# EAGLE schematic Senior_Project_Board_v2 (EAGLE 8.3.2)
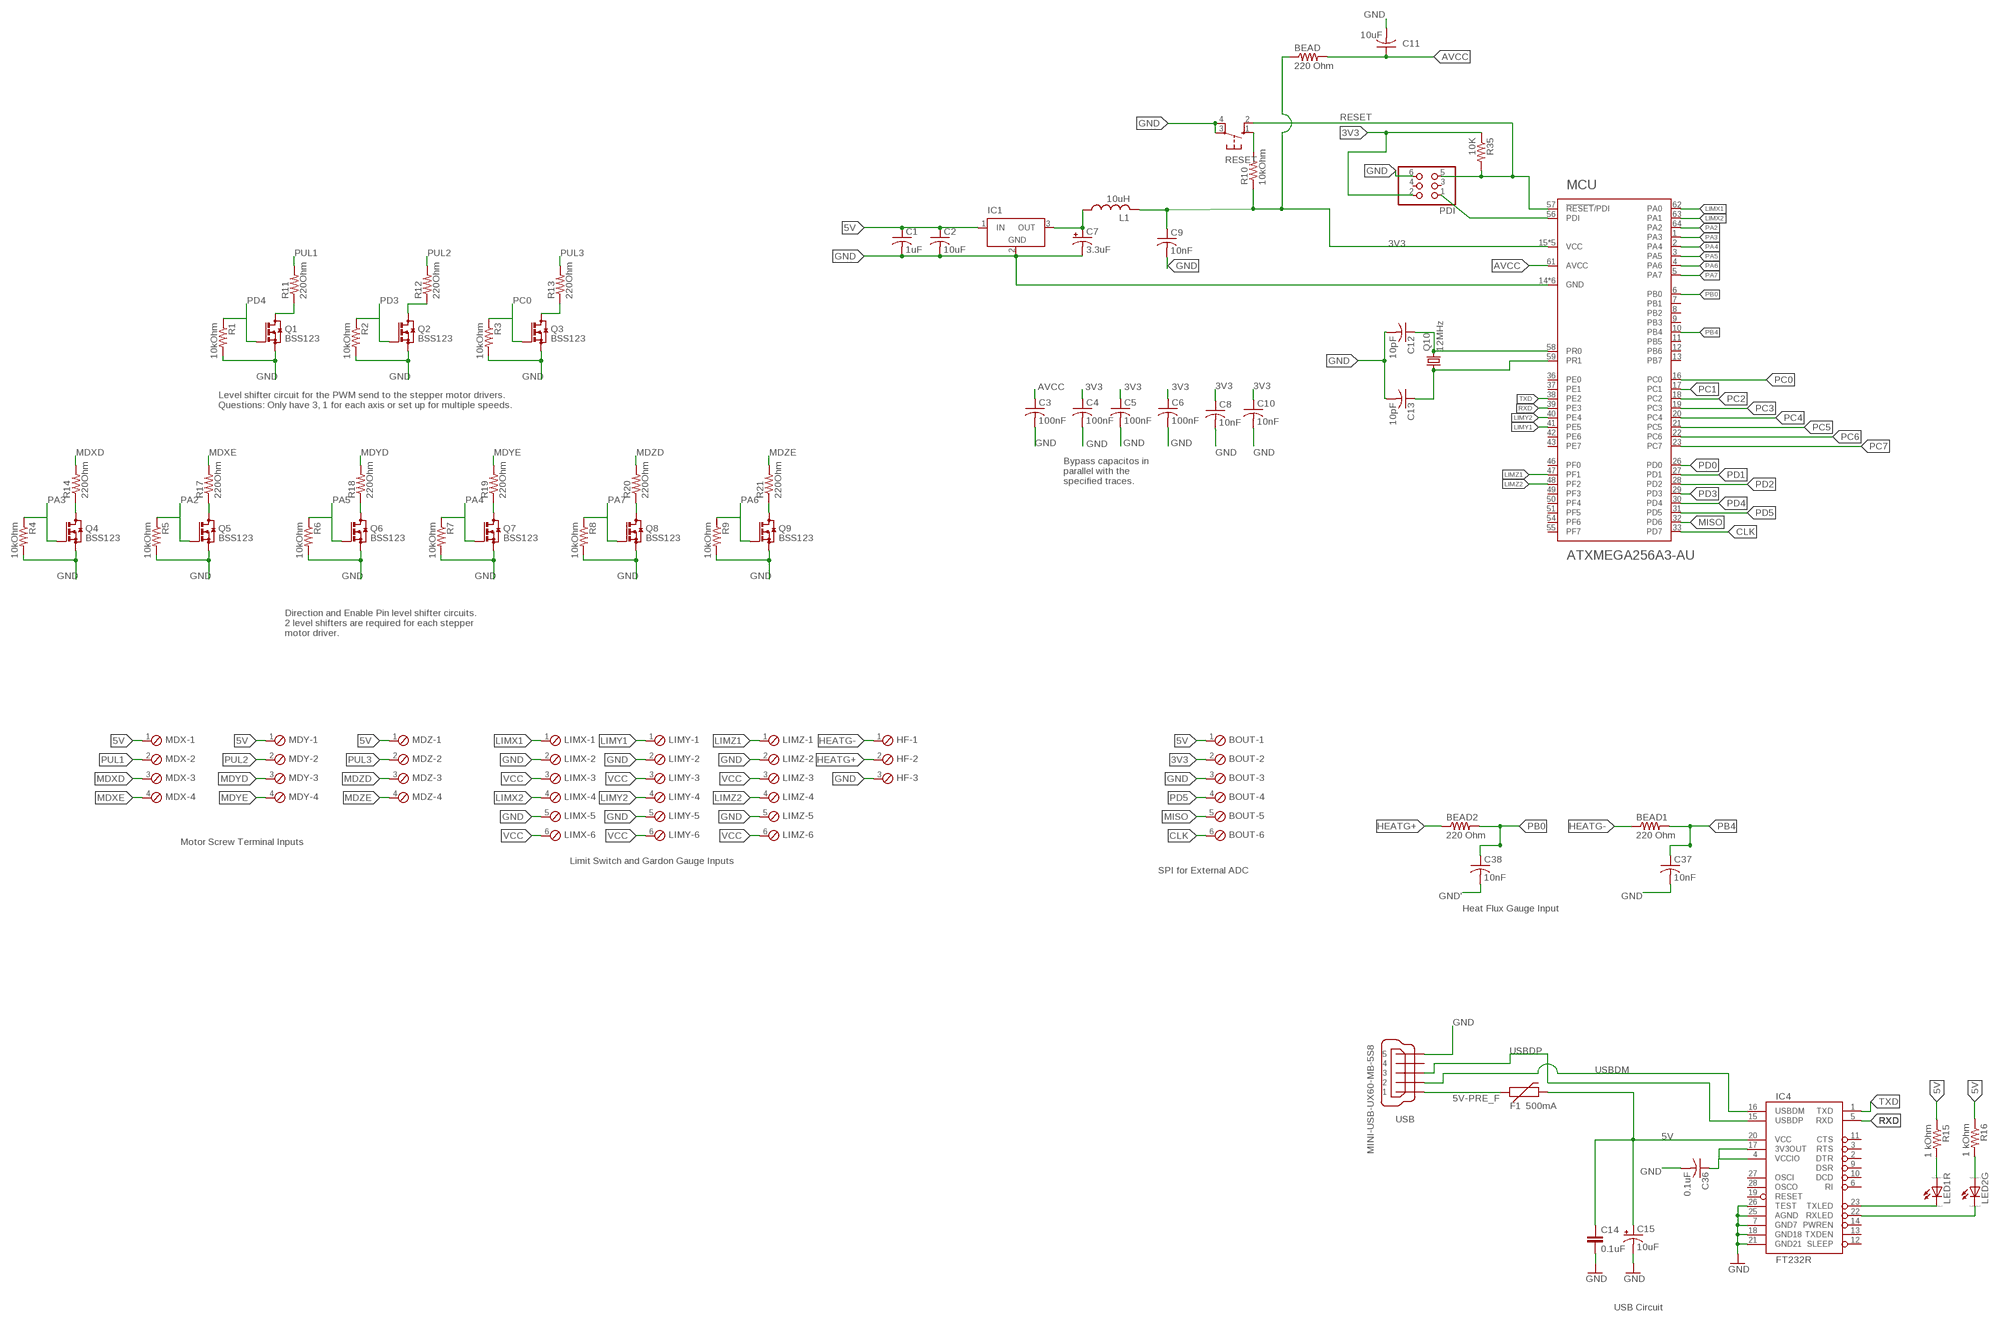
[diagram p0: schematic, sheet 1, part 1 of 3]
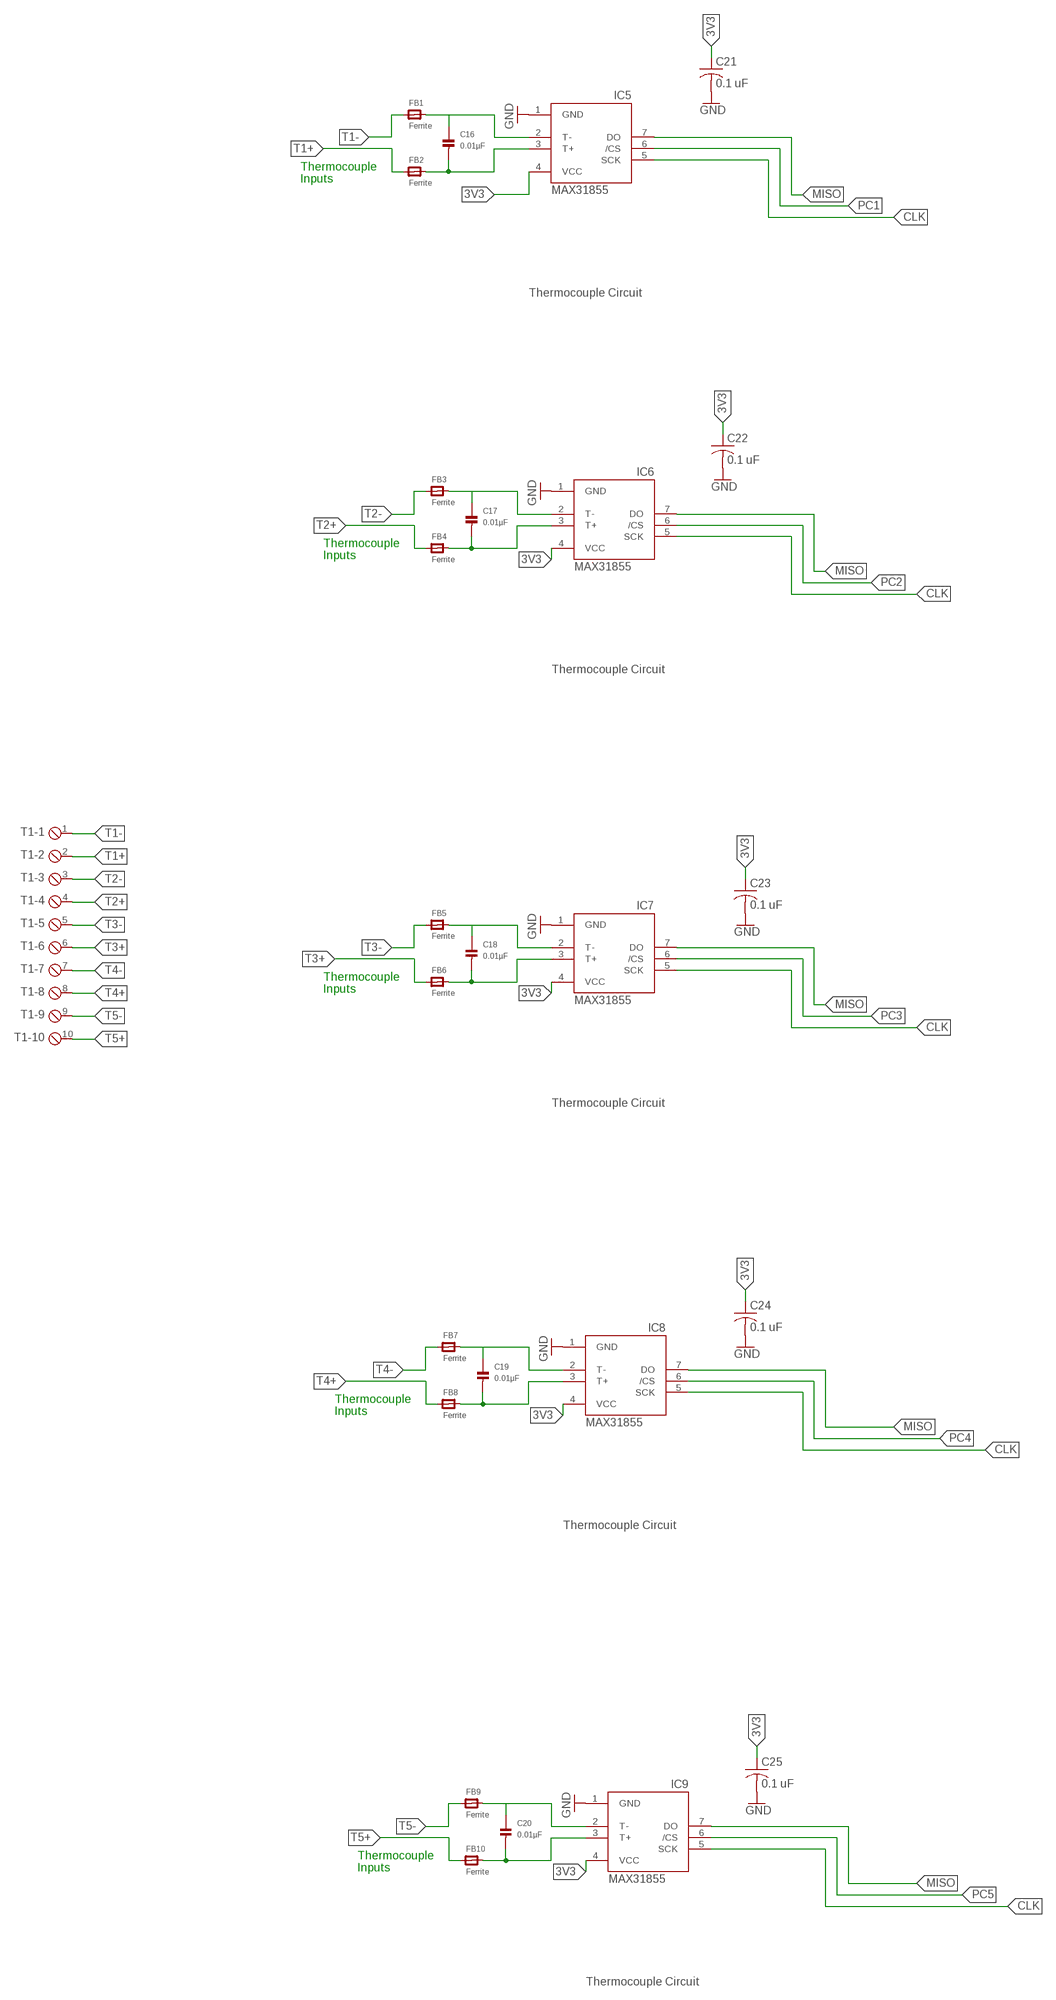
[diagram p1: schematic, sheet 1, part 2 of 3]
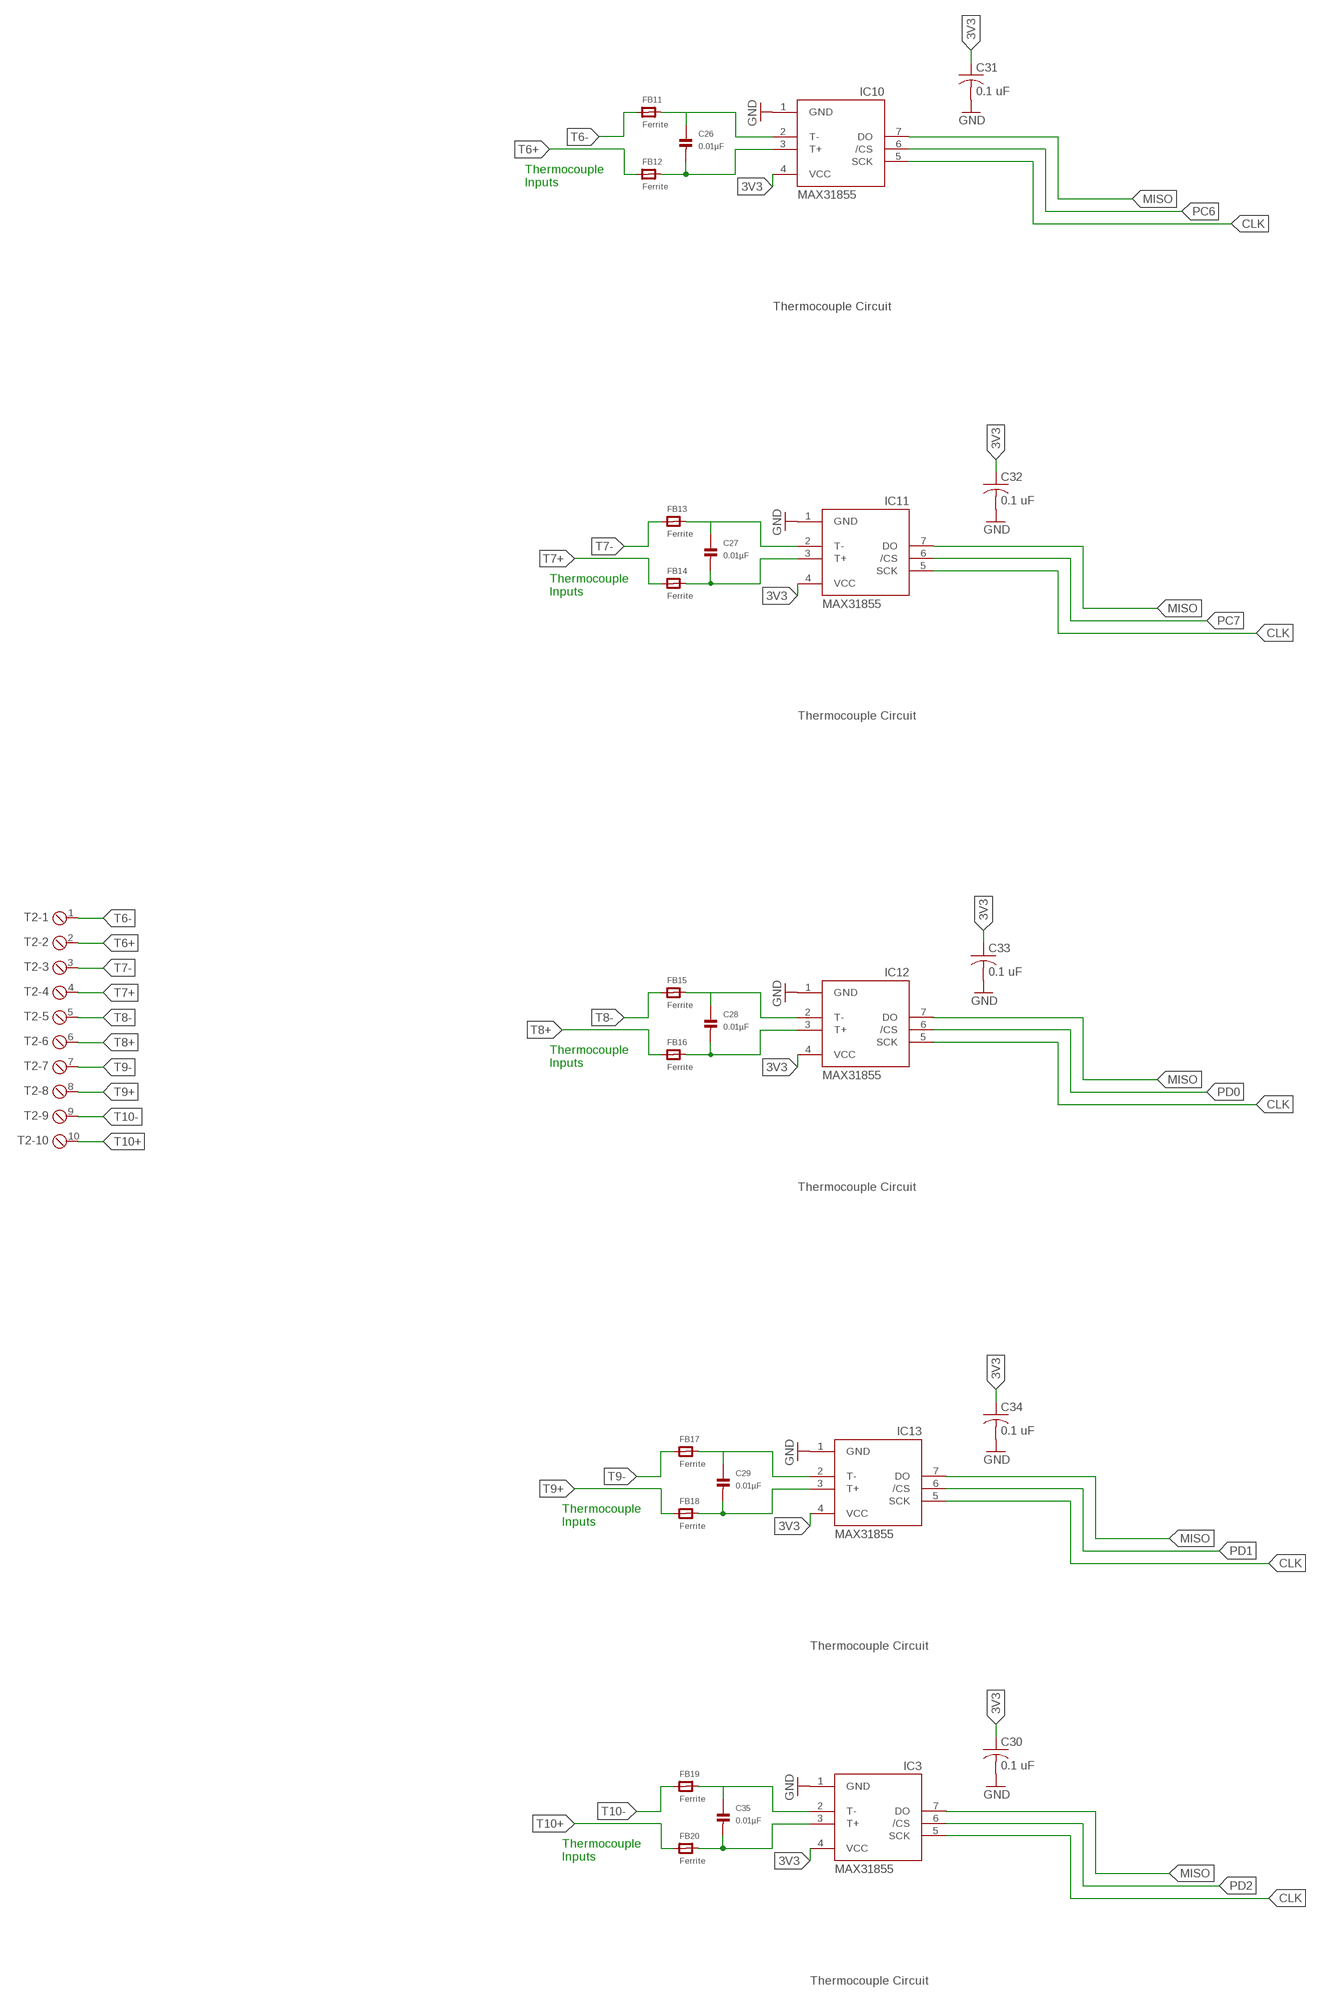
[diagram p2: schematic, sheet 1, part 3 of 3]

## Parts
BEAD  220 Ohm  R-US_R0805  [R0805]
BEAD1  220 Ohm  R-US_R0805  [R0805]
BEAD2  220 Ohm  R-US_R0805  [R0805]
BOUT  MPT6  [6POL254]
C1  1uF  C-USC0805  [C0805]
C2  10uF  C-USC0805  [C0805]
C3  100nF  C-USC0805  [C0805]
C4  100nF  C-USC0805  [C0805]
C5  100nF  C-USC0805  [C0805]
C6  100nF  C-USC0805  [C0805]
C7  3.3uF  CPOL-USCT3216  [CT3216]
C8  10nF  C-USC0805  [C0805]
C9  10nF  C-USC0805  [C0805]
C10  10nF  C-USC0805  [C0805]
C11  10uF  C-USC0805  [C0805]
C12  10pF  C-USC0805  [C0805]
C13  10pF  C-USC0805  [C0805]
C14  0.1uF  0.1UF-25V(+80/-20%)(0603)  [0603-CAP]
C15  10uF  10UF-16V-10%(TANT)  [EIA3216]
C16  0.01µF  CAP_CERAMIC_0805  [_0805]
C17  0.01µF  CAP_CERAMIC_0805  [_0805]
C18  0.01µF  CAP_CERAMIC_0805  [_0805]
C19  0.01µF  CAP_CERAMIC_0805  [_0805]
C20  0.01µF  CAP_CERAMIC_0805  [_0805]
C21  0.1 uF  C-USC0805K  [C0805K]
C22  0.1 uF  C-USC0805K  [C0805K]
C23  0.1 uF  C-USC0805K  [C0805K]
C24  0.1 uF  C-USC0805K  [C0805K]
C25  0.1 uF  C-USC0805K  [C0805K]
C26  0.01µF  CAP_CERAMIC_0805  [_0805]
C27  0.01µF  CAP_CERAMIC_0805  [_0805]
C28  0.01µF  CAP_CERAMIC_0805  [_0805]
C29  0.01µF  CAP_CERAMIC_0805  [_0805]
C30  0.1 uF  C-USC0805K  [C0805K]
C31  0.1 uF  C-USC0805K  [C0805K]
C32  0.1 uF  C-USC0805K  [C0805K]
C33  0.1 uF  C-USC0805K  [C0805K]
C34  0.1 uF  C-USC0805K  [C0805K]
C35  0.01µF  CAP_CERAMIC_0805  [_0805]
C36  0.1uF  C-USC0805  [C0805]
C37  10nF  C-USC0805  [C0805]
C38  10nF  C-USC0805  [C0805]
F1  500mA  PTCSMD  [PTC-1206]
FB1  Ferrite  FERRITE_0805  [_0805]
FB2  Ferrite  FERRITE_0805  [_0805]
FB3  Ferrite  FERRITE_0805  [_0805]
FB4  Ferrite  FERRITE_0805  [_0805]
FB5  Ferrite  FERRITE_0805  [_0805]
FB6  Ferrite  FERRITE_0805  [_0805]
FB7  Ferrite  FERRITE_0805  [_0805]
FB8  Ferrite  FERRITE_0805  [_0805]
FB9  Ferrite  FERRITE_0805  [_0805]
FB10  Ferrite  FERRITE_0805  [_0805]
FB11  Ferrite  FERRITE_0805  [_0805]
FB12  Ferrite  FERRITE_0805  [_0805]
FB13  Ferrite  FERRITE_0805  [_0805]
FB14  Ferrite  FERRITE_0805  [_0805]
FB15  Ferrite  FERRITE_0805  [_0805]
FB16  Ferrite  FERRITE_0805  [_0805]
FB17  Ferrite  FERRITE_0805  [_0805]
FB18  Ferrite  FERRITE_0805  [_0805]
FB19  Ferrite  FERRITE_0805  [_0805]
FB20  Ferrite  FERRITE_0805  [_0805]
HF  MPT3  [3POL254]
IC1  LT1129CST5  [SOT223]
IC3  MAX31855  MAX6675  [SO08]
IC4  FT232R  FT232RLSSOP  [SSOP28DB]
IC5  MAX31855  MAX6675  [SO08]
IC6  MAX31855  MAX6675  [SO08]
IC7  MAX31855  MAX6675  [SO08]
IC8  MAX31855  MAX6675  [SO08]
IC9  MAX31855  MAX6675  [SO08]
IC10  MAX31855  MAX6675  [SO08]
IC11  MAX31855  MAX6675  [SO08]
IC12  MAX31855  MAX6675  [SO08]
IC13  MAX31855  MAX6675  [SO08]
L1  10uH  L-USL1812  [L1812]
LED1R  LED_E  [LED_1206]
LED2G  LED_E  [LED_1206]
LIMX  MPT6  [6POL254]
LIMY  MPT6  [6POL254]
LIMZ  MPT6  [6POL254]
MCU  ATXMEGA256A3-AU  [TQFP-64A-64]
MDX  MPT4  [4POL254]
MDY  MPT4  [4POL254]
MDZ  MPT4  [4POL254]
PDI  PINHD-2X3  [2X03]
Q1  BSS123  [SOT23]
Q2  BSS123  [SOT23]
Q3  BSS123  [SOT23]
Q4  BSS123  [SOT23]
Q5  BSS123  [SOT23]
Q6  BSS123  [SOT23]
Q7  BSS123  [SOT23]
Q8  BSS123  [SOT23]
Q9  BSS123  [SOT23]
Q10  12MHz  CRYSTALHC49S  [HC49/S]
R1  10kOhm  R-US_R0805  [R0805]
R2  10kOhm  R-US_R0805  [R0805]
R3  10kOhm  R-US_R0805  [R0805]
R4  10kOhm  R-US_R0805  [R0805]
R5  10kOhm  R-US_R0805  [R0805]
R6  10kOhm  R-US_R0805  [R0805]
R7  10kOhm  R-US_R0805  [R0805]
R8  10kOhm  R-US_R0805  [R0805]
R9  10kOhm  R-US_R0805  [R0805]
R10  10kOhm  R-US_R0805  [R0805]
R11  220Ohm  R-US_R0805  [R0805]
R12  220Ohm  R-US_R0805  [R0805]
R13  220Ohm  R-US_R0805  [R0805]
R14  220Ohm  R-US_R0805  [R0805]
R15  1 kOhm  R-US_R0805  [R0805]
R16  1 kOhm  R-US_R0805  [R0805]
R17  220Ohm  R-US_R0805  [R0805]
R18  220Ohm  R-US_R0805  [R0805]
R19  220Ohm  R-US_R0805  [R0805]
R20  220Ohm  R-US_R0805  [R0805]
R21  220Ohm  R-US_R0805  [R0805]
R35  10K  R-US_R0805  [R0805]
RESET  10-XX  [B3F-10XX]
T1  MPT10  [10POL254]
T2  MPT10  [10POL254]
USB  MINI-USB-UX60-MB-5S8  [UX60-MB-5S8]

## Nets
3V3: BEAD.1 BOUT.2 C4.1 C5.1 C6.1 C8.1 C9.1 C10.1 C21.1 C22.1 C23.1 C24.1 C25.1 C30.1 C31.1 C32.1 C33.1 C34.1 IC3.4(VCC) IC5.4(VCC) IC6.4(VCC) IC7.4(VCC) IC8.4(VCC) IC9.4(VCC) IC10.4(VCC) IC11.4(VCC) IC12.4(VCC) IC13.4(VCC) L1.2 MCU.15(VCC) MCU.25(VCC) MCU.35(VCC) MCU.45(VCC) MCU.53(VCC) PDI.2 R10.1 R35.1
5V: BOUT.1 C1.1 C2.1 C14.1 C15.A(+) F1.2 IC1.1(IN) IC4.20(VCC) MDX.1 MDY.1 MDZ.1 R15.1 R16.1
5V-PRE_F: F1.1 USB.1
AVCC: BEAD.2 C3.1 C11.1 MCU.61(AVCC)
CLK: BOUT.6 IC3.5(SCK) IC5.5(SCK) IC6.5(SCK) IC7.5(SCK) IC8.5(SCK) IC9.5(SCK) IC10.5(SCK) IC11.5(SCK) IC12.5(SCK) IC13.5(SCK) MCU.33(PD7)
GND: BOUT.3 C1.2 C2.2 C3.2 C4.2 C5.2 C6.2 C7.- C8.2 C9.2 C10.2 C11.2 C12.2 C13.2 C14.2 C15.C(-) C21.2 C22.2 C23.2 C24.2 C25.2 C30.2 C31.2 C32.2 C33.2 C34.2 C36.2 C37.2 HF.3 IC1.2(GND) IC3.1(GND) IC4.7(GND7) IC4.18(GND18) IC4.21(GND21) IC4.25(AGND) IC4.26(TEST) IC5.1(GND) IC6.1(GND) IC7.1(GND) IC8.1(GND) IC9.1(GND) IC10.1(GND) IC11.1(GND) IC12.1(GND) IC13.1(GND) LIMX.2 LIMX.5 LIMY.2 LIMY.5 LIMZ.2 LIMZ.5 MCU.14(GND) MCU.24(GND) MCU.34(GND) MCU.44(GND) MCU.52(GND) MCU.60(GND) PDI.6 Q1.2(S) Q2.2(S) Q3.2(S) Q4.2(S) Q5.2(S) Q6.2(S) Q7.2(S) Q8.2(S) Q9.2(S) R1.2 R2.2 R3.2 R4.2 R5.2 R6.2 R7.2 R8.2 R9.2 RESET.3(P) RESET.4(P1) USB.5
GND': C38.2
HEATG+: BEAD2.1 HF.2
HEATG-: BEAD1.1 HF.1
LIMX1: LIMX.1 MCU.62(PA0)
LIMX2: LIMX.4 MCU.63(PA1)
LIMY1: LIMY.1 MCU.41(PE5)
LIMY2: LIMY.4 MCU.40(PE4)
LIMZ1: LIMZ.1 MCU.47(PF1)
LIMZ2: LIMZ.4 MCU.48(PF2)
MDXD: MDX.3 R14.2
MDXE: MDX.4 R17.2
MDYD: MDY.3 R18.2
MDYE: MDY.4 R19.2
MDZD: MDZ.3 R20.2
MDZE: MDZ.4 R21.2
MISO: BOUT.5 IC3.7(DO) IC5.7(DO) IC6.7(DO) IC7.7(DO) IC8.7(DO) IC9.7(DO) IC10.7(DO) IC11.7(DO) IC12.7(DO) IC13.7(DO) MCU.32(PD6)
N$1: Q5.3(D) R17.1
N$3: C17.1 FB3.2 IC6.2(T-)
N$4: C35.1 FB19.2 IC3.2(T-)
N$5: C16.1 FB1.2 IC5.2(T-)
N$6: MCU.56(PDI) PDI.1
N$7: C16.2 FB2.2 IC5.3(T+)
N$8: LED1R.A R15.2
N$9: C36.1 IC4.4(VCCIO) IC4.17(3V3OUT)
N$10: IC4.23(TXLED) LED1R.C
N$11: LED2G.A R16.2
N$12: Q8.3(D) R20.1
N$13: IC4.22(RXLED) LED2G.C
N$14: Q9.3(D) R21.1
N$15: Q6.3(D) R18.1
N$16: C35.2 FB20.2 IC3.3(T+)
N$17: Q2.3(D) R12.1
N$18: C17.2 FB4.2 IC6.3(T+)
N$19: Q7.3(D) R19.1
N$20: C18.1 FB5.2 IC7.2(T-)
N$21: Q1.3(D) R11.1
N$22: C18.2 FB6.2 IC7.3(T+)
N$23: Q4.3(D) R14.1
N$24: C19.1 FB7.2 IC8.2(T-)
N$26: C19.2 FB8.2 IC8.3(T+)
N$27: Q3.3(D) R13.1
N$28: C20.1 FB9.2 IC9.2(T-)
N$30: C20.2 FB10.2 IC9.3(T+)
N$31: C26.1 FB11.2 IC10.2(T-)
N$32: C26.2 FB12.2 IC10.3(T+)
N$33: C27.1 FB13.2 IC11.2(T-)
N$34: C27.2 FB14.2 IC11.3(T+)
N$35: C28.1 FB15.2 IC12.2(T-)
N$36: C28.2 FB16.2 IC12.3(T+)
N$37: C29.1 FB17.2 IC13.2(T-)
N$38: C29.2 FB18.2 IC13.3(T+)
PA2: MCU.64(PA2) Q5.1(G) R5.1
PA3: MCU.1(PA3) Q4.1(G) R4.1
PA4: MCU.2(PA4) Q7.1(G) R7.1
PA5: MCU.3(PA5) Q6.1(G) R6.1
PA6: MCU.4(PA6) Q9.1(G) R9.1
PA7: MCU.5(PA7) Q8.1(G) R8.1
PB0: BEAD2.2 C38.1 MCU.6(PB0)
PB4: BEAD1.2 C37.1 MCU.10(PB4)
PC0: MCU.16(PC0) Q3.1(G) R3.1
PC1: IC5.6(/CS) MCU.17(PC1)
PC2: IC6.6(/CS) MCU.18(PC2)
PC3: IC7.6(/CS) MCU.19(PC3)
PC4: IC8.6(/CS) MCU.20(PC4)
PC5: IC9.6(/CS) MCU.21(PC5)
PC6: IC10.6(/CS) MCU.22(PC6)
PC7: IC11.6(/CS) MCU.23(PC7)
PD0: IC12.6(/CS) MCU.26(PD0)
PD1: IC13.6(/CS) MCU.27(PD1)
PD2: IC3.6(/CS) MCU.28(PD2)
PD3: MCU.29(PD3) Q2.1(G) R2.1
PD4: MCU.30(PD4) Q1.1(G) R1.1
PD5: BOUT.4 MCU.31(PD5)
PUL1: MDX.2 R11.2
PUL2: MDY.2 R12.2
PUL3: MDZ.2 R13.2
RESET: MCU.57(!RESET!/PDI) PDI.5 R35.2 RESET.2(S1)
RXD: IC4.5(RXD) MCU.39(PE3)
SW_PULLUP: R10.2 RESET.1(S)
T1+: FB2.1 T1.2
T1-: FB1.1 T1.1
T2+: FB4.1 T1.4
T2-: FB3.1 T1.3
T3+: FB6.1 T1.6
T3-: FB5.1 T1.5
T4+: FB8.1 T1.8
T4-: FB7.1 T1.7
T5+: FB10.1 T1.10
T5-: FB9.1 T1.9
T6+: FB12.1 T2.2
T6-: FB11.1 T2.1
T7+: FB14.1 T2.4
T7-: FB13.1 T2.3
T8+: FB16.1 T2.6
T8-: FB15.1 T2.5
T9+: FB18.1 T2.8
T9-: FB17.1 T2.7
T10+: FB20.1 T2.10
T10-: FB19.1 T2.9
TXD: IC4.1(TXD) MCU.38(PE2)
USBDM: IC4.16(USBDM) USB.2
USBDP: IC4.15(USBDP) USB.3
V_REG_OUT: C7.+ IC1.3(OUT) L1.1
VCC: LIMX.3 LIMX.6 LIMY.3 LIMY.6 LIMZ.3 LIMZ.6
XT1: C12.1 MCU.58(PR0) Q10.2
XT2: C13.1 MCU.59(PR1) Q10.1
Unconnected: IC4.2(DTR) IC4.3(RTS) IC4.6(RI) IC4.9(DSR) IC4.10(DCD) IC4.11(CTS) IC4.12(SLEEP) IC4.13(TXDEN) IC4.14(PWREN) IC4.19(RESET) IC4.27(OSCI) IC4.28(OSCO) MCU.7(PB1) MCU.8(PB2) MCU.9(PB3) MCU.11(PB5) MCU.12(PB6) MCU.13(PB7) MCU.36(PE0) MCU.37(PE1) MCU.42(PE6) MCU.43(PE7) MCU.46(PF0) MCU.49(PF3) MCU.50(PF4) MCU.51(PF5) MCU.54(PF6) MCU.55(PF7) PDI.3 PDI.4 USB.4

## Notes on the sheet
- Thermocouple
  Inputs
- Thermocouple
  Inputs
- Thermocouple Circuit
- Thermocouple Circuit
- Thermocouple
  Inputs
- Thermocouple
  Inputs
- Thermocouple Circuit
- Thermocouple Circuit
- Level shifter circuit for the PWM send to the stepper motor drivers. 
  Questions: Only have 3, 1 for each axis or set up for multiple speeds.
- Bypass capacitos in
  parallel with the 
  specified traces.
- Direction and Enable Pin level shifter circuits.
  2 level shifters are required for each stepper
  motor driver.
- Thermocouple
  Inputs
- Thermocouple
  Inputs
- Thermocouple Circuit
- Thermocouple Circuit
- Motor Screw Terminal Inputs
- Limit Switch and Gardon Gauge Inputs
- SPI for External ADC
- Heat Flux Gauge Input
- Thermocouple
  Inputs
- Thermocouple
  Inputs
- Thermocouple Circuit
- Thermocouple Circuit
- Thermocouple
  Inputs
- USB Circuit
- Thermocouple Circuit
- Thermocouple
  Inputs
- Thermocouple Circuit

## Power pins joined to a net without a drawn wire
GND: IC1.4(GND)

## Library data of the parts
BEAD BEAD1 BEAD2 R1-R21 = rcl:R-US_: RESISTOR, American symbol
BOUT LIMX LIMY LIMZ = 2POL254_VICTOR:MPT6: PHOENIX CONNECTOR; OC_FARNELL: unknown; OC_NEWARK: unknown
C1-C6 C8-C13 C36-C38 = rcl:C-US: CAPACITOR, American symbol
C7 = rcl:CPOL-US: POLARIZED CAPACITOR, American symbol
C14 = SparkFun-Capacitors:0.1UF-25V(+80/-20%)(0603): CAP-00810 Ceramic Standard decoupling cap; PROD_ID: CAP-00810
C15 = SparkFun-Capacitors:10UF-16V-10%(TANT): CAP-00811 1206/EIA-3216 Tantalum capacitor; PROD_ID: CAP-00811
C16-C20 C26-C29 C35 = microbuilder:CAP_CERAMIC: Ceramic Capacitors 0402 - 0402 Surface Mount Capacitors 16pF 50V 5% [Digikey: 445-4899-2-ND] 18pF 50V 5% [Digikey: 490-1281-2-ND] 22pF 50V 5% [Digikey: 490-1283-2-ND] 68pF 50V 5% [Digikey: 490-1289-2-ND] 0.1uF 10V 10% [Digikey: 490-1318-2-ND] 1.0uF 6.3V 10% [Digikey: 490-1320-2-ND] 0603 - 0603 Surface Mount Capacitors 16 pF 50V 5% [Digikey: 445-5051-2-ND] 22 pF 50V [Digikey: PCC220ACVTR-ND] 33 pF 50V 5% [Digikey: 490-1415-1-ND] 56pF 50V 5% [Digikey: 490-1421-1-ND] 220pF 50V 5% [Digikey: 445-1285-1-ND] 680 pF 50V 2200 pF 50V 5% C0G [Digikey: 445-1297-1-ND] 5600 pF 100V 5% X7R [Digikey: 478-3711-1-ND] 0.1 µF 25V 10% [Digikey: PCC2277TR-ND] 0.22 µF 16V 10% X7R [Digikey: 445-1318-1-ND] 1.0 µF 25V 10% [Digikey: 445-5146-2-ND] 0603 - RF Specific 3pF 250V +/-0.1pF RF [Digikey: 712-1347-1-ND] 18 pF 250V 5% [Digikey: 478-3505-1-ND or 712-1322-1-ND] 56 pF 250V 5% C0G RF [Digikey: 490-4867-1-ND] 68 pF 250V RF [Digikey: 490-4868-1-ND] 0805 - 0805 Surface Mount Capacitors 220 pF 250V 2% RF Ceramic Capacitor [Digikey: 712-1398-1-ND] 1000 pF 50V 2% NP0 Ceramic Capacitor [Digikey: 478-3760-1-ND] 0.1 µF 25V 10% Ceramic Capacitor [Digikey: PCC1828TR-ND] 1.0 µF 16V 10% Ceramic Capacitor[Digikey: 490-1691-2-ND] 10.0 µF 10V 10% Ceramic Capacitor[Digikey: 709-1228-1-ND] 10.0 uF 16V 10% Ceramic Capacitor [Digikey: 478-5165-2-ND] 47 uF 6.3V 20% Ceramic Capacitor [Digikey: 587-1779-1-ND or 399-5506-1-ND] 1206 - 1206 Surface Mount Capacitors 47uF 10V 20% Ceramic Capacitor [Digikey: 490-5528-1-ND or 399-5508-1-ND or 445-6010-1-ND] 100uF 6.3V -20%, +80% Y5V Ceramic Capacitor (Digikey: 490-4512-1-ND, Mouser: 81-GRM31CF50J107ZE1L)
C21-C25 C30-C34 = adafruit:C-US: CAPACITOR, American symbol
F1 = SparkFun:PTC: Resettable Fuse PTC Resettable Fuse. Spark Fun Electronics SKU : COM-08357
FB1-FB20 = microbuilder:FERRITE: Ferrite Bead 0603 MMZ1608B121C - 120 Ohm @ 100MHz, 600mA, 0.15 Ohm DC Resistance - Digikey: 445-2164-1-ND BK1608HW121-T - 120 Ohm, 600mA Ferrite Chip - Digikey: 587-1876-2-ND 0805 HZ0805B272R-10 - 2.7K Ohm @ 100MHz, 200mA, 0.8 Ohm DC Resistance - Digikey: 240-2504-1-ND (see also Murata BLM21BD272SN1L) MMZ2012Y152B - 1.5K Ohm @ 100MHz, 500mA, 0.4 Ohm DC Resistance - Digikey: 445-1560-1-ND - Mainly for high frequency (80-400MHz) MMZ2012R102A - 1K Ohm @ 100MHz, 500mA, 0.3 Ohm DC Resistance - Digikey: 445-1555-2-ND - More general purpose (10-200MHz)
HF = 2POL254_VICTOR:MPT3: PHOENIX CONNECTOR; OC_FARNELL: unknown; OC_NEWARK: unknown
IC1 = linear-technology:LT1129CST5: VOLTAGE REGULATOR with shutdown; MPN: LT1129CST-5#PBF; OC_FARNELL: 1663375; OC_NEWARK: 57M2069
IC3 IC5-IC13 = adafruit:MAX6675
IC4 = SparkFun:FT232RL: USB UART FT232RL 4th Generation USB UART (USB <-> Serial) Controller. Spark Fun Electronics SKU : COM-00650
L1 = rcl:L-US: INDUCTOR, American symbol
LED1R LED2G = eagle-ltspice:LED_E: LED Source: http://www.osram.convergy.de Source: www.luxeon.com Source: www.kingbright.com; SPICEMODEL: NONE; SPICEPREFIX: D; SPICETYPE: diode
MCU = atmel-xmega:ATXMEGA256A3: 8/16-bit XMEGA A3 Microcontroller Features High-performance, Low-power 8/16-bit Atmel® AVR® XMEGATM Microcontroller Non-volatile Program and Data Memories – 64 KB - 256 KB of In-System Self-Programmable Flash – 4 KB - 8 KB Boot Code Section with Independent Lock Bits – 2 KB - 4 KB EEPROM – 4 KB - 16 KB Internal SRAM Peripheral Features – Four-channel DMA Controller with support for external requests – Eight-channel Event System – Seven 16-bit Timer/Counters Four Timer/Counters with 4 Output Compare or Input Capture channels Three Timer/Counters with 2 Output Compare or Input Capture channels High Resolution Extensions on all Timer/Counters Advanced Waveform Extension on one Timer/Counter – Seven USARTs IrDA Extension on 1 USART – AES and DES Crypto Engine – Two Two-wire Interfaces with dual address match (I2C and SMBus compatible) – Three SPI (Serial Peripheral Interfaces) – 16-bit Real Time Counter with Separate Oscillator – Two Eight-channel, 12-bit, 2 Msps Analog to Digital Converters – One Two-channel, 12-bit, 1 Msps Digital to Analog Converter – Four Analog Comparators with Window compare function – External Interrupts on all General Purpose I/O pins – Programmable Watchdog Timer with Separate On-chip Ultra Low Power Oscillator Special Microcontroller Features – Power-on Reset and Programmable Brown-out Detection – Internal and External Clock Options with PLL – Programmable Multi-level Interrupt Controller – Sleep Modes: Idle, Power-down, Standby, Power-save, Extended Standby – Advanced Programming, Test and Debugging Interfaces JTAG (IEEE 1149.1 Compliant) Interface for test, debug and programming PDI (Program and Debug Interface) for programming, test and debugging I/O and Packages – 50 Programmable I/O Lines – 64-lead TQFP – 64-pad QFN Operating Voltage – 1.6 – 3.6V Speed performance – 0 – 12 MHz @ 1.6 – 3.6V – 0 – 32 MHz @ 2.7 – 3.6V
MDX MDY MDZ = 2POL254_VICTOR:MPT4: PHOENIX CONNECTOR; OC_FARNELL: unknown; OC_NEWARK: unknown
PDI = pinhead:PINHD-2X3: PIN HEADER
Q1-Q9 = transistor-small-signal:BSS123: N-CHANNEL MOS FET
Q10 = crystal:CRYSTAL: CRYSTAL; OC_FARNELL: 1667008; OC_NEWARK: unknown
R35 = adafruit:R-US_: RESISTOR, American symbol
RESET = switch-omron:10-XX: OMRON SWITCH; MPN: B3F-1000; OC_FARNELL: 176432; OC_NEWARK: 36M3542
T1 T2 = 2POL254_VICTOR:MPT10: PHOENIX CONNECTOR; OC_FARNELL: unknown; OC_NEWARK: unknown
USB = con-hirose:MINI-USB-: MINI USB Connector Source: http://www.hirose.co.jp/cataloge_hp/e24000019.pdf; OC_FARNELL: unknown; OC_NEWARK: unknown

## Net classes
1 power: width 0.254 mm